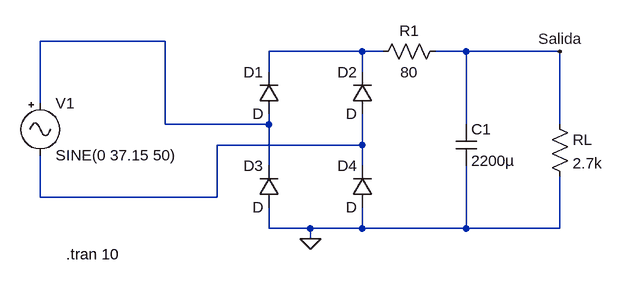
[diagram p0: schematic PuenteDiodos.asc]
PuenteDiodos.asc, the LTspice schematic file:
Version 4.1
SHEET 1 904 680
WIRE 208 32 16 32
WIRE 512 48 368 48
WIRE 544 48 512 48
WIRE 672 48 624 48
WIRE 816 48 672 48
WIRE 368 80 368 48
WIRE 512 80 512 48
WIRE 16 128 16 32
WIRE 208 160 208 32
WIRE 368 160 368 144
WIRE 368 160 208 160
WIRE 672 160 672 48
WIRE 816 160 816 48
WIRE 512 192 512 144
WIRE 512 192 288 192
WIRE 368 224 368 160
WIRE 512 224 512 192
WIRE 16 272 16 208
WIRE 288 272 288 192
WIRE 288 272 16 272
WIRE 368 320 368 288
WIRE 432 320 368 320
WIRE 512 320 512 288
WIRE 512 320 432 320
WIRE 672 320 672 224
WIRE 672 320 512 320
WIRE 816 320 816 240
WIRE 816 320 672 320
WIRE 432 336 432 320
FLAG 432 336 0
FLAG 816 48 Salida
SYMBOL Misc\\signal 16 112 R0
WINDOW 123 0 0 Left 0
WINDOW 39 0 0 Left 0
SYMATTR InstName V1
SYMATTR Value SINE(0 37.15 50)
SYMBOL cap 656 160 R0
SYMATTR InstName C1
SYMATTR Value 2200µ
SYMBOL res 800 144 R0
SYMATTR InstName RL
SYMATTR Value 2.7k
SYMBOL diode 384 144 R180
WINDOW 0 24 64 Left 2
WINDOW 3 24 0 Left 2
SYMATTR InstName D1
SYMBOL diode 528 144 R180
WINDOW 0 24 64 Left 2
WINDOW 3 24 0 Left 2
SYMATTR InstName D2
SYMBOL diode 384 288 R180
WINDOW 0 24 64 Left 2
WINDOW 3 24 0 Left 2
SYMATTR InstName D3
SYMBOL diode 528 288 R180
WINDOW 0 24 64 Left 2
WINDOW 3 24 0 Left 2
SYMATTR InstName D4
SYMBOL res 640 32 R90
WINDOW 0 0 56 VBottom 2
WINDOW 3 32 56 VTop 2
SYMATTR InstName R1
SYMATTR Value 80
TEXT 56 360 Left 2 !.tran 10

The netlist it stands for:
* PuenteDiodos.asc
V1 N001 N003 SINE(0 37.15 50)
C1 Salida 0 2200µ
RL Salida 0 2.7k
D1 N001 N002 D
D2 N003 N002 D
D3 0 N001 D
D4 0 N003 D
R1 Salida N002 80
.model D D
.lib standard.dio
.tran 10
.backanno
.end

* Results of the author's LTspice run, read from the files saved beside the schematic
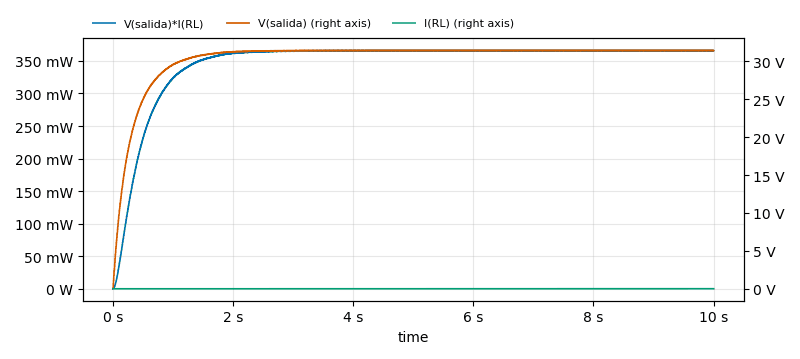
[diagram p1: Transient Analysis of PuenteDiodos.asc, plotted from the saved traces]
* Transient Analysis, 1 run:
*   V(salida)*I(RL): min 0 W, max 366.2 mW, average 347.5 mW, rms 352.4 mW, last 365.7 mW
*   V(salida): min 0 V, max 31.45 V, average 30.41 V, rms 30.63 V, last 31.42 V
*   I(RL): min 0 A, max 11.65 mA, average 11.26 mA, rms 11.35 mA, last 11.64 mA